# Altium schematic sheet AnalExtend.SchDoc
size A4
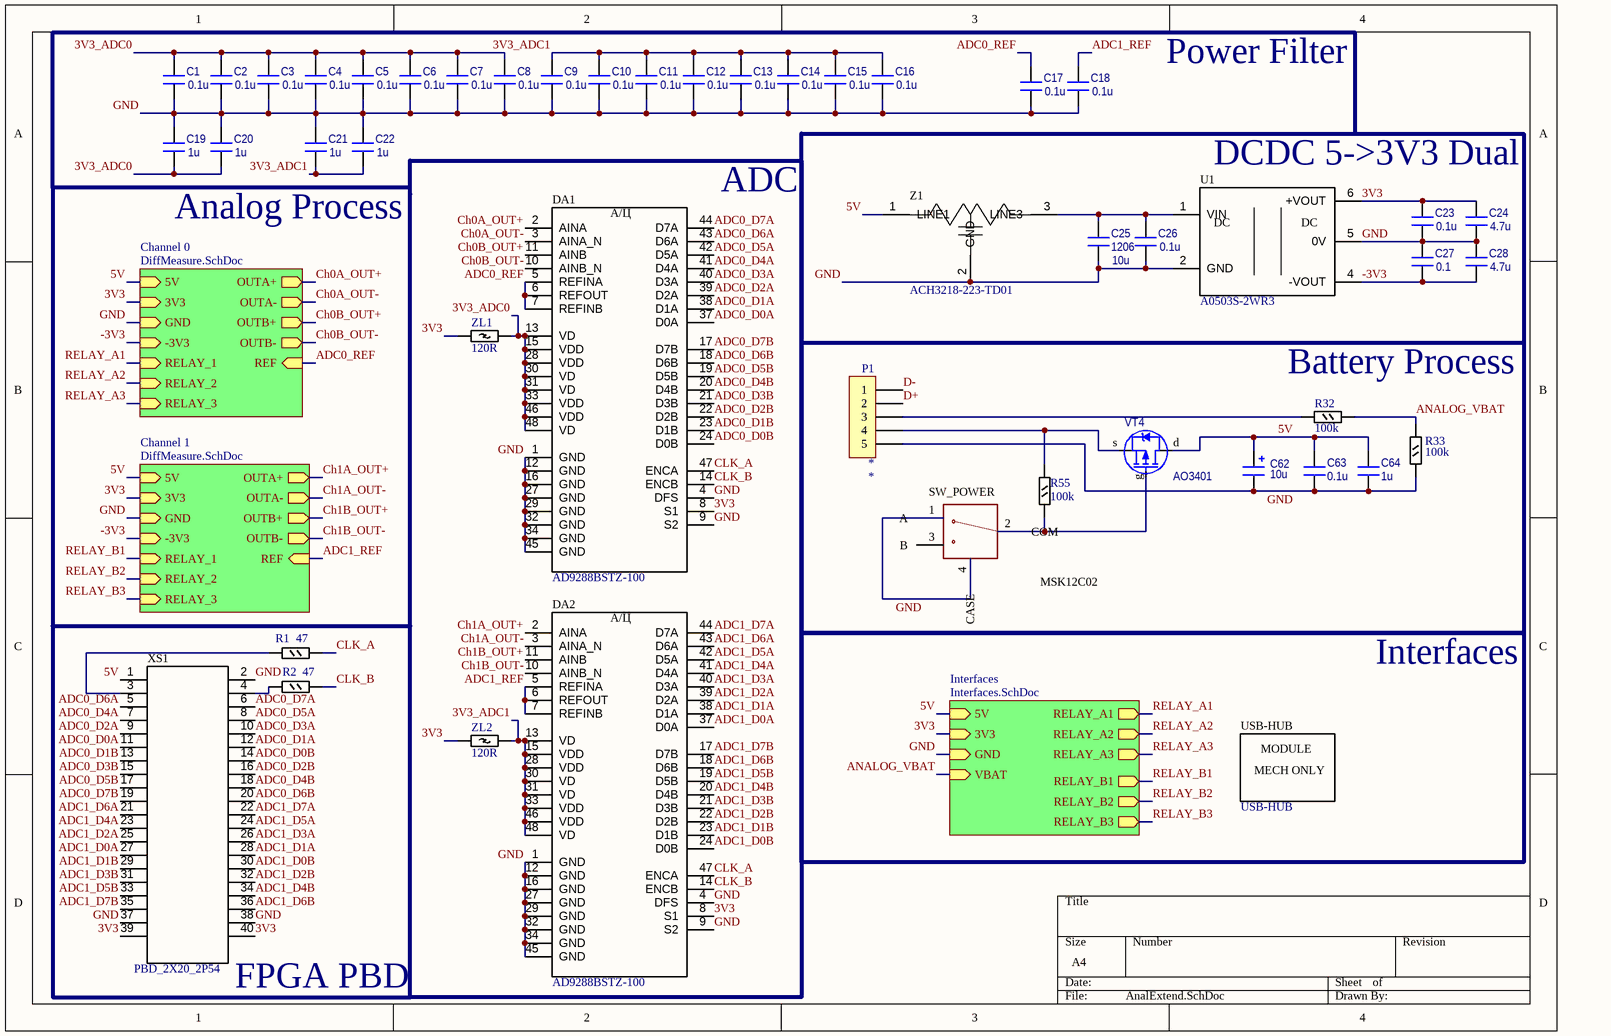
[diagram p0: AnalExtend.SchDoc]

## Parts
C1  value 0.1u  [CAPC2012(0805)N]
C2  value 0.1u  [CAPC2012(0805)N]
C3  value 0.1u  [CAPC2012(0805)N]
C4  value 0.1u  [CAPC2012(0805)N]
C5  value 0.1u  [CAPC2012(0805)N]
C6  value 0.1u  [CAPC2012(0805)N]
C7  value 0.1u  [CAPC2012(0805)N]
C8  value 0.1u  [CAPC2012(0805)N]
C9  value 0.1u  [CAPC2012(0805)N]
C10  value 0.1u  [CAPC2012(0805)N]
C11  value 0.1u  [CAPC2012(0805)N]
C12  value 0.1u  [CAPC2012(0805)N]
C13  value 0.1u  [CAPC2012(0805)N]
C14  value 0.1u  [CAPC2012(0805)N]
C15  value 0.1u  [CAPC2012(0805)N]
C16  value 0.1u  [CAPC2012(0805)N]
C17  value 0.1u  [CAPC2012(0805)N]
C18  value 0.1u  [CAPC2012(0805)N]
C19  value 1u  [CAPC2012(0805)N]
C20  value 1u  [CAPC2012(0805)N]
C21  value 1u  [CAPC2012(0805)N]
C22  value 1u  [CAPC2012(0805)N]
C23  value 0.1u  [CAPC2012(0805)N]
C24  value 4.7u  [CAPC2012(0805)N]
C25  value 10u  Package: 1206  [CAP_CER_1206]  (hidden comment: 2700p 50V)
C26  value 0.1u  [CAPC2012(0805)N]
C27  value 0.1  [CAPC2012(0805)N]
C28  value 4.7u  [CAPC2012(0805)N]
C62  10u  [CAPMP3528X210N]
C63  0.1u  [CAPC2012(0805)N]
C64  1u  [CAPC2012(0805)N]
DA1  AD9288BSTZ-100  [AD9288BSTZ-100_LQFP48]
DA2  AD9288BSTZ-100  [AD9288BSTZ-100_LQFP48]
P1  P_HEADER_1x5  [P_HEADER_1x5_2.54_ANGLE]  (value not drawn)
R1  47  [RESC2012(0805)N]
R2  47  [RESC2012(0805)N]
R32  100k  [RESC2012(0805)N]
R33  100k  [RESC2012(0805)N]
R55  100k  [RESC2012(0805)N]
SW_POWER  MSK12C02  [MSK12C02]
U1  A0503S-2WR3  [A0503S-2WR3_SIP5]
USB-HUB  USB-HUB  [MINGWU_29P3X18P9_MECH]
VT4  AO3401  [SOT23-3N]
XS1  PBD_2X20_2P54  [PBD_2X20_2P54_THT]
Z1  ACH3218-223-TD01  [ACH3218_3TERM_FILTER]
ZL1  120R  [INDC1608(0603)N]
ZL2  120R  [INDC1608(0603)N]

## Blocks framed on the sheet
ADC: DA1 DA2 ZL1 ZL2

## Sub-sheets
Channel 0 = DiffMeasure.SchDoc: 3V3 (in), GND (in), REF (in), -3V3 (in), 5V (in), OUTA- (out), OUTB+ (out), OUTA+ (out), OUTB- (out), RELAY_1 (in), RELAY_2 (in), RELAY_3 (in)
Channel 1 = DiffMeasure.SchDoc: 3V3 (in), GND (in), REF (in), -3V3 (in), 5V (in), OUTA- (out), OUTB+ (out), OUTB- (out), OUTA+ (out), RELAY_2 (in), RELAY_3 (in), RELAY_1 (in)
Interfaces = Interfaces.SchDoc: 5V (in), 3V3 (in), GND (in), VBAT (in), RELAY_B3 (out), RELAY_B2 (out), RELAY_B1 (out), RELAY_A3 (out), RELAY_A2 (out), RELAY_A1 (out)

## Nets
3V3: C23.1 C24.1 DA1.8(S1) DA2.8(S1) U1.6(+VOUT) XS1.39 XS1.40 ZL1.1 ZL2.1 ; sheet Channel 0/3V3, sheet Channel 1/3V3, sheet Interfaces/3V3
3V3_ADC0: C1.1 C2.1 C3.1 C4.1 C5.1 C6.1 C7.1 C8.1 C19.2 C20.2 DA1.13(VD) DA1.15(VDD) DA1.28(VDD) DA1.30(VD) DA1.31(VD) DA1.33(VDD) DA1.46(VDD) DA1.48(VD) ZL1.2
3V3_ADC1: C9.1 C10.1 C11.1 C12.1 C13.1 C14.1 C15.1 C16.1 C21.2 C22.2 DA2.13(VD) DA2.15(VDD) DA2.28(VDD) DA2.30(VD) DA2.31(VD) DA2.33(VDD) DA2.46(VDD) DA2.48(VD) ZL2.2
5V: C62.1 C63.1 C64.1 VT4.d XS1.1 Z1.1(LINE1) ; sheet Channel 0/5V, sheet Channel 1/5V, sheet Interfaces/5V
-3V3: C27.2 C28.2 U1.4(-VOUT) ; sheet Channel 0/-3V3, sheet Channel 1/-3V3
ADC0_D0A: DA1.37(D0A) XS1.11
ADC0_D0B: DA1.24(D0B) XS1.14
ADC0_D1A: DA1.38(D1A) XS1.12
ADC0_D1B: DA1.23(D1B) XS1.13
ADC0_D2A: DA1.39(D2A) XS1.9
ADC0_D2B: DA1.22(D2B) XS1.16
ADC0_D3A: DA1.40(D3A) XS1.10
ADC0_D3B: DA1.21(D3B) XS1.15
ADC0_D4A: DA1.41(D4A) XS1.7
ADC0_D4B: DA1.20(D4B) XS1.18
ADC0_D5A: DA1.42(D5A) XS1.8
ADC0_D5B: DA1.19(D5B) XS1.17
ADC0_D6A: DA1.43(D6A) XS1.5
ADC0_D6B: DA1.18(D6B) XS1.20
ADC0_D7A: DA1.44(D7A) XS1.6
ADC0_D7B: DA1.17(D7B) XS1.19
ADC0_REF: C17.1 DA1.5(REFINA) DA1.6(REFOUT) DA1.7(REFINB) ; sheet Channel 0/REF
ADC1_D0A: DA2.37(D0A) XS1.27
ADC1_D0B: DA2.24(D0B) XS1.30
ADC1_D1A: DA2.38(D1A) XS1.28
ADC1_D1B: DA2.23(D1B) XS1.29
ADC1_D2A: DA2.39(D2A) XS1.25
ADC1_D2B: DA2.22(D2B) XS1.32
ADC1_D3A: DA2.40(D3A) XS1.26
ADC1_D3B: DA2.21(D3B) XS1.31
ADC1_D4A: DA2.41(D4A) XS1.23
ADC1_D4B: DA2.20(D4B) XS1.34
ADC1_D5A: DA2.42(D5A) XS1.24
ADC1_D5B: DA2.19(D5B) XS1.33
ADC1_D6A: DA2.43(D6A) XS1.21
ADC1_D6B: DA2.18(D6B) XS1.36
ADC1_D7A: DA2.44(D7A) XS1.22
ADC1_D7B: DA2.17(D7B) XS1.35
ADC1_REF: C18.1 DA2.5(REFINA) DA2.6(REFOUT) DA2.7(REFINB) ; sheet Channel 1/REF
ANALOG_VBAT: R32.2 R33.1 ; sheet Interfaces/VBAT
Ch0A_OUT+: DA1.2(AINA) ; sheet Channel 0/OUTA+
Ch0A_OUT-: DA1.3(AINA_N) ; sheet Channel 0/OUTA-
Ch0B_OUT+: DA1.11(AINB) ; sheet Channel 0/OUTB+
Ch0B_OUT-: DA1.10(AINB_N) ; sheet Channel 0/OUTB-
Ch1A_OUT+: DA2.2(AINA) ; sheet Channel 1/OUTA+
Ch1A_OUT-: DA2.3(AINA_N) ; sheet Channel 1/OUTA-
Ch1B_OUT+: DA2.11(AINB) ; sheet Channel 1/OUTB+
Ch1B_OUT-: DA2.10(AINB_N) ; sheet Channel 1/OUTB-
CLK_A: DA1.47(ENCA) DA2.47(ENCA) R1.2
CLK_B: DA1.14(ENCB) DA2.14(ENCB) R2.2
D+: P1.2
D-: P1.1
GND: C1.2 C2.2 C3.2 C4.2 C5.2 C6.2 C7.2 C8.2 C9.2 C10.2 C11.2 C12.2 C13.2 C14.2 C15.2 C16.2 C17.2 C18.2 C19.1 C20.1 C21.1 C22.1 C23.2 C24.2 C25.2 C26.2 C27.1 C28.1 C62.2 C63.2 C64.2 DA1.1(GND) DA1.4(DFS) DA1.9(S2) DA1.12(GND) DA1.16(GND) DA1.27(GND) DA1.29(GND) DA1.32(GND) DA1.34(GND) DA1.45(GND) DA2.1(GND) DA2.4(DFS) DA2.9(S2) DA2.12(GND) DA2.16(GND) DA2.27(GND) DA2.29(GND) DA2.32(GND) DA2.34(GND) DA2.45(GND) P1.5 R33.2 SW_POWER.1(A) SW_POWER.4(CASE) U1.2(GND) U1.5(0V) XS1.2 XS1.37 XS1.38 Z1.2(GND) ; sheet Channel 0/GND, sheet Channel 1/GND, sheet Interfaces/GND
RELAY_A1: sheet Channel 0/RELAY_1, sheet Interfaces/RELAY_A1
RELAY_A2: sheet Channel 0/RELAY_2, sheet Interfaces/RELAY_A2
RELAY_A3: sheet Channel 0/RELAY_3, sheet Interfaces/RELAY_A3
RELAY_B1: sheet Channel 1/RELAY_1, sheet Interfaces/RELAY_B1
RELAY_B2: sheet Channel 1/RELAY_2, sheet Interfaces/RELAY_B2
RELAY_B3: sheet Channel 1/RELAY_3, sheet Interfaces/RELAY_B3
NetC25_1: C25.1 C26.1 U1.1(VIN) Z1.3(LINE3)
NetP1_3: P1.3 R32.1
NetP1_4: P1.4 R55.2 VT4.s
NetR1_1: R1.1 XS1.3
NetR2_1: R2.1 XS1.4
NetR55_1: R55.1 SW_POWER.2(COM) VT4.g

Not connected (* = marked no-connect by the designer): SW_POWER 3(B)

## Notes on the sheet
- Power Filter
- DCDC 5->3V3 Dual
- Analog Process
- Battery Process
- Interfaces
- (near XS1) FPGA PBD
- (in symbol A0503S-2WR3) DC
- (in symbol AD9288BSTZ-100) А/Ц
- (in symbol MINGWU_29P3X18P9_MECH) MODULE; MECH ONLY

## Library data of the parts
C1-C24 C26-C28 C63 C64 = CAPC2012(0805): Voltage: *; Part Number: CAPC2012(0805)
  C1-C24 C26-C28: Package: 0805
  C63: Package: 0.1u; Value: *
  C64: Package: 1u; Value: *
C25 = 12065A272GAT2A: Cap Cer MLCC SMD 50V 2700p C0G NP0 1206 2%; Voltage: *; Part Number: 12065A272GAT2A; MPN: 12065A272GAT2A; Mouser Part Number: 581-12065A272G; HelpURL: https://eu.mouser.com/ProductDetail/AVX/12065A272GAT2A?qs=ZdaRgelF1GpUV998NMwU6A%3D%3D
C62 = TAJB105K035SNJ: Tantalum Capacitors - Solid SMD 35V 1uF 10%; MPN: 581-TAJB105K035S; Part Number: TAJB105K035SNJ; Mouser Part Number: TAJB105K035SNJ; HelpURL: https://eu.mouser.com/ProductDetail/KYOCERA-AVX/TAJB105K035SNJ?qs=sGAEpiMZZMtZ1n0r9vR22f0Jgorj1M1uNDk8%2FjXB31s%3D
DA1 DA2 = AD9288BSTZ-100: Analog Devices dual 8-bit ADC, 100 MSPS, LQFP-48 ST-48
P1 = P_HEADER_1x5: Pin Header; SCH_Footprint: *; Value: *
R1 R2 R32 R33 R55 = RESC2012(0805): Part Number: RESC2012(0805); Package: 0805
SW_POWER = MSK12C02: Shou Han MSK12C02 miniature SMD SPDT slide switch, ON-ON, 12 VDC 50 mA; four case tabs are pin 4; Manufacturer: SHOU HAN; Manufacturer Part Number: MSK12C02; LCSC Part Number: C431540
U1 = A0503S-2WR3: YLPTEC 2 W isolated DC/DC, 5 V input, +/-3.3 V dual output
USB-HUB = MINGWU_29P3X18P9_MECH: Mechanical-only Mingwudianzi module; no electrical pins
VT4 = PJA3433_R1_00001: MOSFET 30V P-Channel Enhancement Mode MOSFET-ESD Protected; pin to pad: d>3 g>1 s>2; Part Number: PJA3433_R1_00001; HelpURL: https://eu.mouser.com/ProductDetail/241-PJA3433_R1_00001; Digi-Key Part Number: 3757-PJA3433_R1_00001CT-ND; Manufacturer Part Number: PJA3433_R1_00001; Package: SOT-23-3
XS1 = PBD_2X20_2P54: PBD-40 vertical 2x20 2.54 mm female through-hole socket
Z1 = ACH3218-223-TD01: TDK 22 nF three-terminal T-type EMI filter, 20 V, 1.5 A
ZL1 ZL2 = Ferite1608(0603): ferite bead; Manufacturer Part Number: BLM15PX471SN1D; Part Number: Ferite1608(0603); Price$: 0.14; Package: 0402; HelpURL: https://eu.mouser.com/ProductDetail/Murata-Electronics/BLM15PX471SN1D?qs=%2Fha2pyFadugFXr5biOyskwIVnWnam4MScgU55pluOIVbLGfRcJswjw%3D%3D; Mouser Part Number: BLM15PX471SN1D